# Altium schematic sheet BL8028.SchDoc
size A4
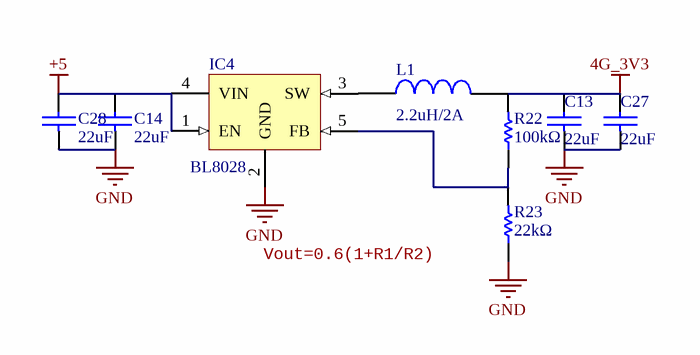
[diagram p0: BL8028.SchDoc]

## Parts
C13  22uF  [C_0603]
C14  22uF  [C_0603]
C27  22uF  [C_0603]
C28  22uF  [C_0603]
IC4  BL8028  [SOT23-5]
L1  2.2uH/2A  [L_1008]
R22  100kΩ  [R_0402]
R23  22kΩ  [R_0402]

## Nets
4G_3V3: C13.2 C27.2 L1.2 R22.2
+5: C14.2 C28.2 IC4.1(EN) IC4.4(VIN)
GND: C13.1 C14.1 C27.1 C28.1 IC4.2(GND) R23.1
NetIC4_3: IC4.3(SW) L1.1
NetIC4_5: IC4.5(FB) R22.1 R23.2

## Notes on the sheet
- Vout=0.6(1+R1/R2)

## Library data of the parts
C13 C14 C27 C28 = Cap_Chip: 贴片电容; Manufacturer_Name: *; Manufacturer_Part_Number: *
IC4 = BL8028: DC-DC 芯片; Manufacturer_Name: BL(上海贝岭); Manufacturer_Part_Number: BL8028CB5TR; LCSC: C266177
L1 = Ind_Chip: 小功率电感; Manufacturer_Name: chilisin(奇力新); Manufacturer_Part_Number: BDCD002520122R2MS1
R22 R23 = Res_Chip: 贴片电阻; Manufacturer_Name: *; Manufacturer_Part_Number: *